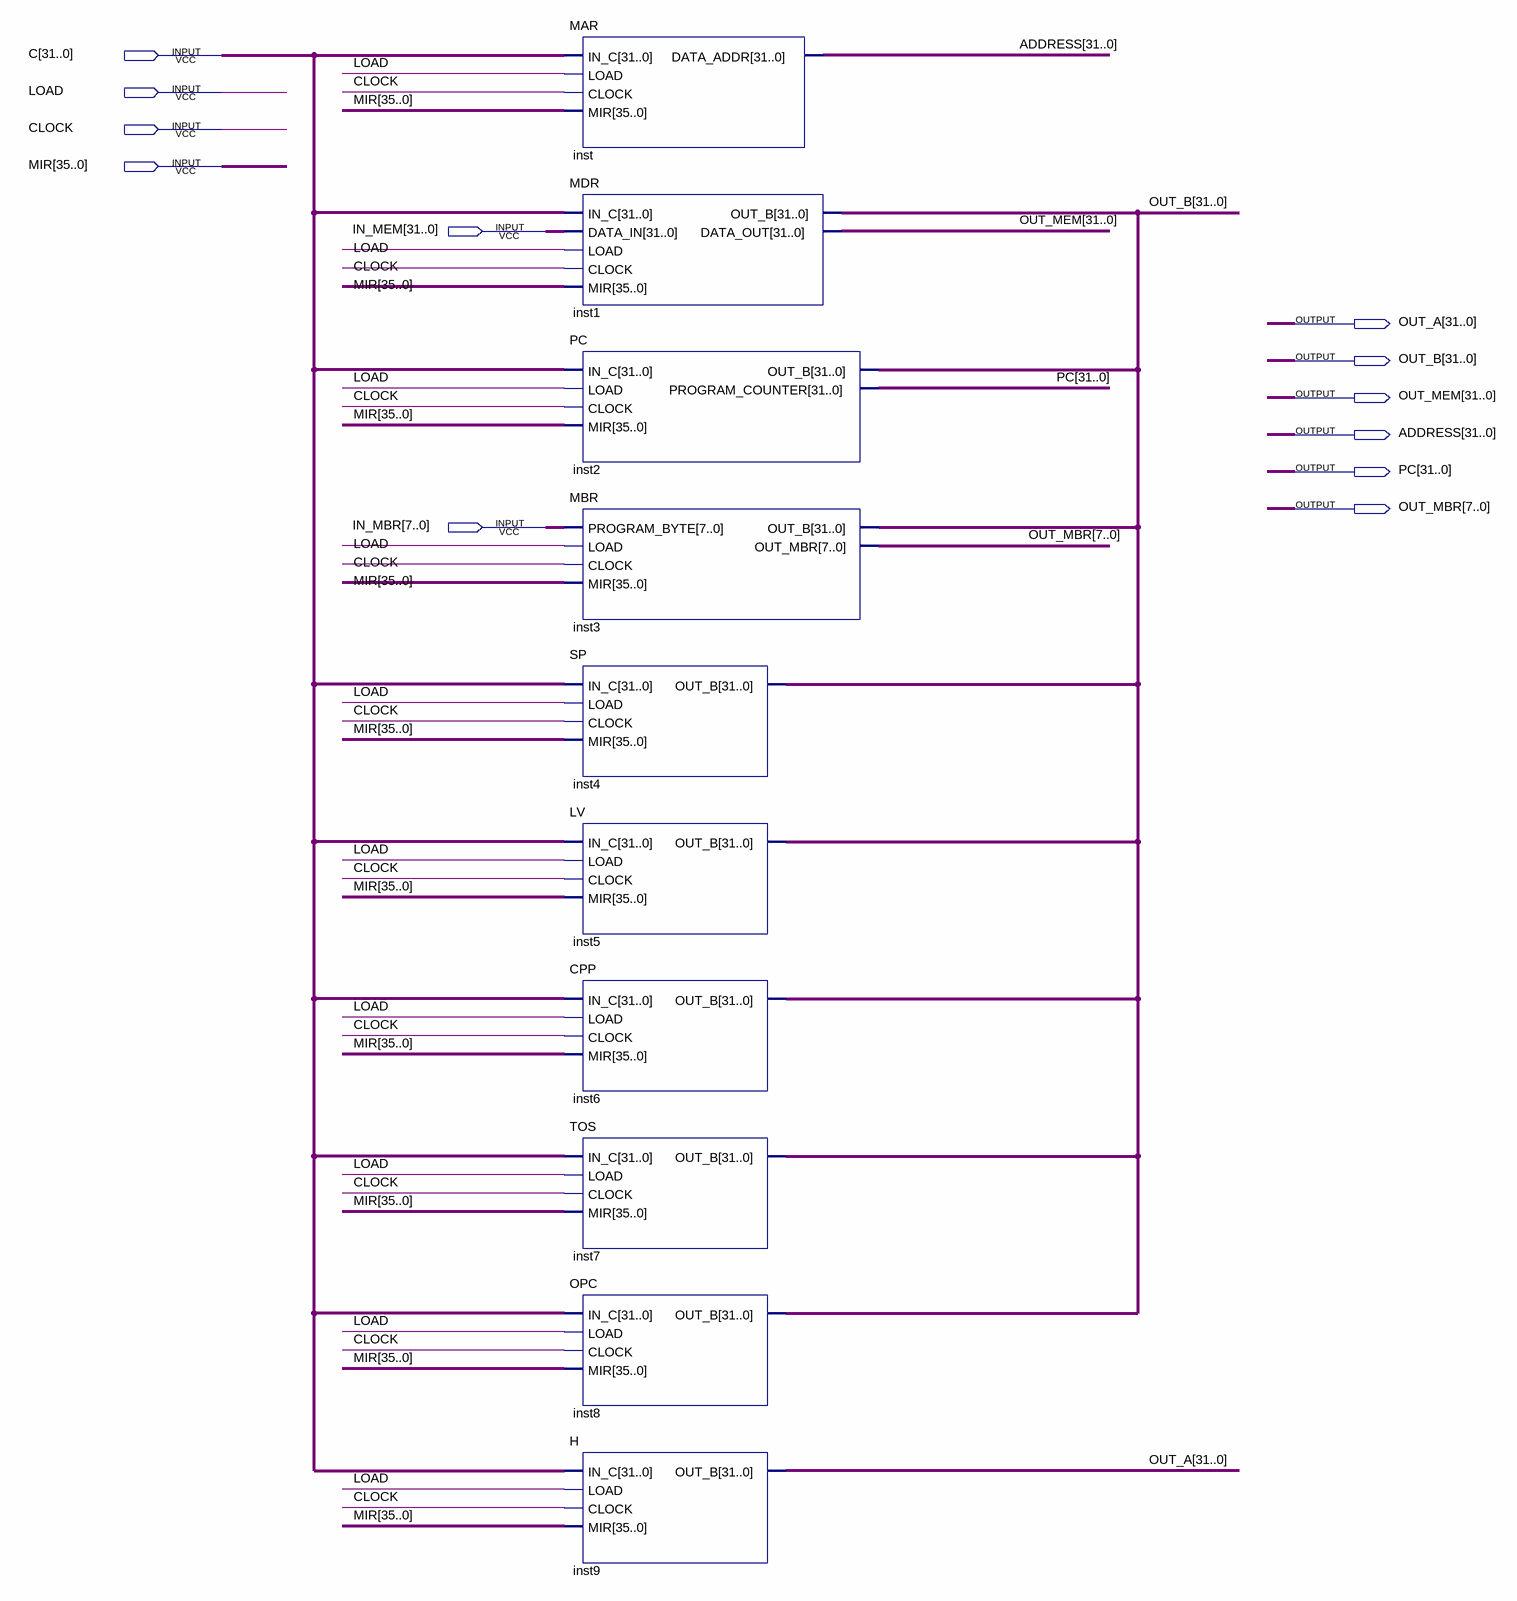
[diagram p0: schematic sheet]
// Quartus schematic REGISTER_BANK.bdf as structural Verilog: 10 symbols, 12 pins
module REGISTER_BANK (
  input  [31:0] C,
  input  LOAD,
  input  CLOCK,
  input  [35:0] MIR,
  input  [31:0] IN_MEM,
  input  [7:0] IN_MBR,
  output [31:0] OUT_A,
  output [31:0] OUT_B,
  output [31:0] OUT_MEM,
  output [31:0] ADDRESS,
  output [31:0] PC,
  output [7:0] OUT_MBR
);

  MAR inst (.IN_C(C), .LOAD(LOAD), .CLOCK(CLOCK), .MIR(MIR), .DATA_ADDR(ADDRESS));
  MDR inst1 (.IN_C(C), .DATA_IN(IN_MEM), .LOAD(LOAD), .CLOCK(CLOCK), .MIR(MIR), .OUT_B(OUT_B), .DATA_OUT(OUT_MEM));
  PC inst2 (.IN_C(C), .LOAD(LOAD), .CLOCK(CLOCK), .MIR(MIR), .OUT_B(OUT_B), .PROGRAM_COUNTER(PC));
  MBR inst3 (.PROGRAM_BYTE(IN_MBR), .LOAD(LOAD), .CLOCK(CLOCK), .MIR(MIR), .OUT_B(OUT_B), .OUT_MBR(OUT_MBR));
  SP inst4 (.IN_C(C), .LOAD(LOAD), .CLOCK(CLOCK), .MIR(MIR), .OUT_B(OUT_B));
  LV inst5 (.IN_C(C), .LOAD(LOAD), .CLOCK(CLOCK), .MIR(MIR), .OUT_B(OUT_B));
  CPP inst6 (.IN_C(C), .LOAD(LOAD), .CLOCK(CLOCK), .MIR(MIR), .OUT_B(OUT_B));
  TOS inst7 (.IN_C(C), .LOAD(LOAD), .CLOCK(CLOCK), .MIR(MIR), .OUT_B(OUT_B));
  OPC inst8 (.IN_C(C), .LOAD(LOAD), .CLOCK(CLOCK), .MIR(MIR), .OUT_B(OUT_B));
  H inst9 (.IN_C(C), .LOAD(LOAD), .CLOCK(CLOCK), .MIR(MIR), .OUT_B(OUT_A));
endmodule
